# EAGLE design Amplificador_Ganho_1000_Versão5 (EAGLE 4.09)
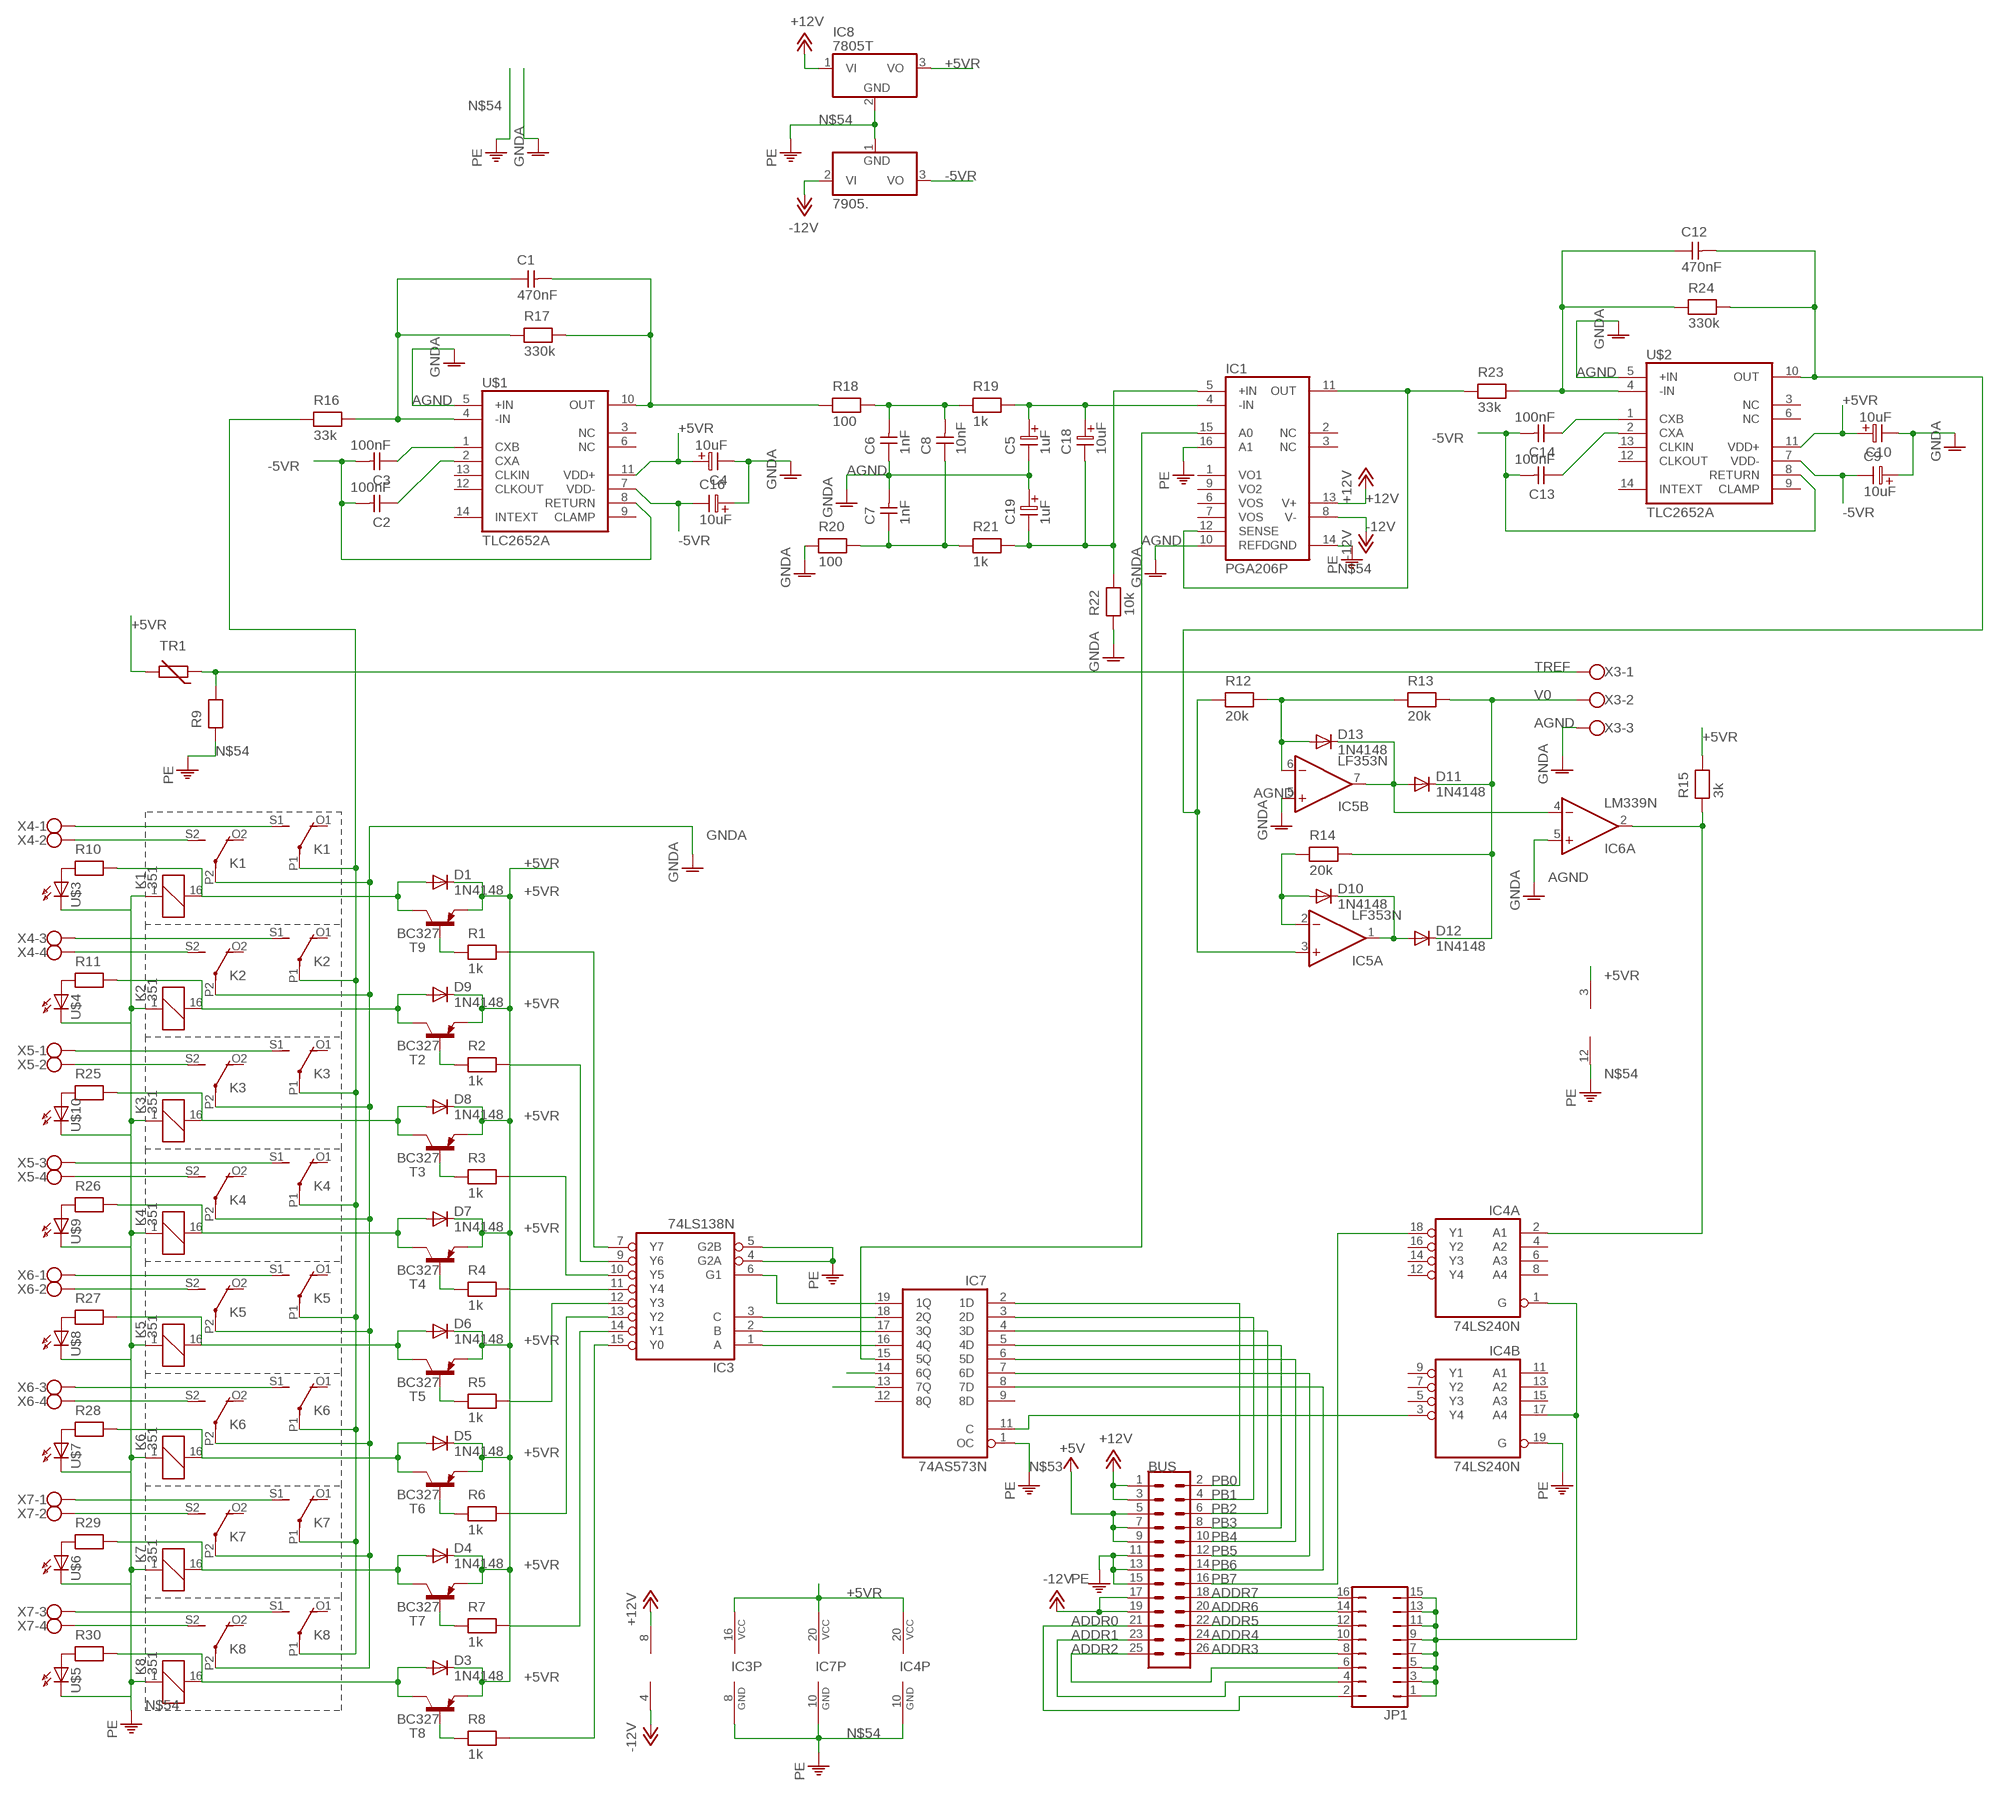
[diagram p0: schematic, sheet 1]

## Parts
7905.  7905T  [TO220H]
BUS  ML26  [ML26]
C1  470nF  CAPNP-5  [C-5]
C2  100nF  CAPNP-5  [C-5]
C3  100nF  CAPNP-5  [C-5]
C4  10uF  ELC-2,5L  [ES-2,5L]
C5  1uF  ELC-2,5L  [ES-2,5L]
C6  1nF  CAPNP-5  [C-5]
C7  1nF  CAPNP-5  [C-5]
C8  10nF  CAPNP-5  [C-5]
C9  10uF  ELC-2,5L  [ES-2,5L]
C10  10uF  ELC-2,5L  [ES-2,5L]
C12  470nF  CAPNP-5  [C-5]
C13  100nF  CAPNP-5  [C-5]
C14  100nF  CAPNP-5  [C-5]
C16  10uF  ELC-2,5L  [ES-2,5L]
C18  10uF  ELC-2,5L  [ES-2,5L]
C19  1uF  ELC-2,5L  [ES-2,5L]
D1  1N4148  [DO35-10]
D3  1N4148  [DO35-10]
D4  1N4148  [DO35-10]
D5  1N4148  [DO35-10]
D6  1N4148  [DO35-10]
D7  1N4148  [DO35-10]
D8  1N4148  [DO35-10]
D9  1N4148  [DO35-10]
D10  1N4148  [DO35-10]
D11  1N4148  [DO35-10]
D12  1N4148  [DO35-10]
D13  1N4148  [DO35-10]
IC1  PGA206P  [DIL16]
IC3  74LS138N  [DIL16]
IC4  74LS240N  [DIL20]
IC5  LF353N  [DIL08]
IC6  LM339N  [DIL14]
IC7  74AS573N  [DIL20]
IC8  7805T  [TO220H]
JP1  JP8Q  [JP8Q]
K1  351  [351]
K2  351  [351]
K3  351  [351]
K4  351  [351]
K5  351  [351]
K6  351  [351]
K7  351  [351]
K8  351  [351]
R1  1k  RESEU-10  [R-10]
R2  1k  RESEU-10  [R-10]
R3  1k  RESEU-10  [R-10]
R4  1k  RESEU-10  [R-10]
R5  1k  RESEU-10  [R-10]
R6  1k  RESEU-10  [R-10]
R7  1k  RESEU-10  [R-10]
R8  1k  RESEU-10  [R-10]
R9  RESEU-10  [R-10]
R10  RESEU-10  [R-10]
R11  RESEU-10  [R-10]
R12  20k  RESEU-10  [R-10]
R13  20k  RESEU-10  [R-10]
R14  20k  RESEU-10  [R-10]
R15  3k  RESEU-10  [R-10]
R16  33k  RESEU-10  [R-10]
R17  330k  RESEU-10  [R-10]
R18  100  RESEU-10  [R-10]
R19  1k  RESEU-10  [R-10]
R20  100  RESEU-10  [R-10]
R21  1k  RESEU-10  [R-10]
R22  10k  RESEU-10  [R-10]
R23  33k  RESEU-10  [R-10]
R24  330k  RESEU-10  [R-10]
R25  RESEU-10  [R-10]
R26  RESEU-10  [R-10]
R27  RESEU-10  [R-10]
R28  RESEU-10  [R-10]
R29  RESEU-10  [R-10]
R30  RESEU-10  [R-10]
T2  BC327  [TO92]
T3  BC327  [TO92]
T4  BC327  [TO92]
T5  BC327  [TO92]
T6  BC327  [TO92]
T7  BC327  [TO92]
T8  BC327  [TO92]
T9  BC327  [TO92]
TR1  THERM-2,5  [RS-2,5]
U$1  TLC2652A  [DIP14]
U$2  TLC2652A  [DIP14]
U$3  LED3MM  [LED3MM]
U$4  LED3MM  [LED3MM]
U$5  LED3MM  [LED3MM]
U$6  LED3MM  [LED3MM]
U$7  LED3MM  [LED3MM]
U$8  LED3MM  [LED3MM]
U$9  LED3MM  [LED3MM]
U$10  LED3MM  [LED3MM]
X3  AK500/3  [AK500/3]
X4  AK500/4  [AK500/4]
X5  AK500/4  [AK500/4]
X6  AK500/4  [AK500/4]
X7  AK500/4  [AK500/4]

## Nets
+5V: BUS.5 BUS.7 BUS.9
+5VR: C4.1 C10.1 D1.C D3.C D4.C D5.C D6.C D7.C D8.C D9.C IC3.16(VCC) IC4.20(P:VCC) IC6.3(P:V+) IC7.20(VCC) IC8.3(VO) R15.2 T2.1(E) T3.1(E) T4.1(E) T5.1(E) T6.1(E) T7.1(E) T8.1(E) T9.1(E) TR1.2 U$1.11(VDD+) U$2.11(VDD+)
+12V: BUS.1 BUS.3 IC1.13(V+) IC5.8(P:V+) IC8.1(VI)
-5VR: 7905..3(VO) C2.2 C3.2 C9.2 C13.2 C14.2 C16.2 U$1.7(VDD-) U$1.8(RETURN) U$2.7(VDD-) U$2.8(RETURN)
-12V: 7905..2(VI) BUS.17 BUS.19 IC1.8(V-) IC5.4(P:V-)
ADDR0: BUS.21 JP1.2
ADDR1: BUS.23 JP1.4
ADDR2: BUS.25 JP1.6
ADDR3: BUS.26 JP1.8
ADDR4: BUS.24 JP1.10
ADDR5: BUS.22 JP1.12
ADDR6: BUS.20 JP1.14
ADDR7: BUS.18 JP1.16
AGND: C4.2 C5.2 C6.1 C7.2 C9.1 C10.2 C16.1 C19.1 IC1.10(REF) IC5.5(B:+IN) IC6.5(A:+IN) R20.1 R22.1 U$1.5(+IN) U$2.5(+IN) X3.3 ; supply symbol labelled GNDA
GNDA: K1.P2(3:P) K2.P2(3:P) K3.P2(3:P) K4.P2(3:P) K5.P2(3:P) K6.P2(3:P) K7.P2(3:P) K8.P2(3:P)
N$1: IC7.14(6Q)
N$2: R5.1 T5.2(B)
N$3: IC3.7(Y7) R1.2
N$4: IC3.9(Y6) R2.2
N$5: IC3.10(Y5) R3.2
N$6: IC3.11(Y4) R4.2
N$7: IC3.15(Y0) R8.2
N$8: IC3.14(Y1) R7.2
N$9: IC3.13(Y2) R6.2
N$10: R1.1 T9.2(B)
N$11: IC3.1(A) IC7.16(4Q)
N$12: IC3.2(B) IC7.17(3Q)
N$13: IC3.3(C) IC7.18(2Q)
N$14: IC3.6(G1) IC7.19(1Q)
N$15: D6.A K5.16 R27.2 T5.3(C)
N$16: C18.2 C19.2 IC1.5(+IN) R21.2 R22.2
N$17: R2.1 T2.2(B)
N$18: D1.A K1.16 R10.2 T9.3(C)
N$19: D9.A K2.16 R11.2 T2.3(C)
N$20: R6.1 T6.2(B)
N$21: R3.1 T3.2(B)
N$22: D8.A K3.16 R25.2 T3.3(C)
N$23: D5.A K6.16 R28.2 T6.3(C)
N$24: R4.1 T4.2(B)
N$25: D7.A K4.16 R26.2 T4.3(C)
N$26: R7.1 T7.2(B)
N$27: D4.A K7.16 R29.2 T7.3(C)
N$28: R8.1 T8.2(B)
N$29: D3.A K8.16 R30.2 T8.3(C)
N$30: IC3.12(Y3) R5.2
N$32: IC4.2(A:A1) IC6.2(A:OUT) R15.1
N$33: IC4.1(A:G) IC4.17(B:A4) JP1.1 JP1.3 JP1.5 JP1.7 JP1.9 JP1.11 JP1.13 JP1.15
N$34: IC7.13(7Q)
N$35: K1.S1(2:S) X4.1
N$36: K1.S2(3:S) X4.2
N$37: K2.S1(2:S) X4.3
N$38: K2.S2(3:S) X4.4
N$39: K3.S1(2:S) X5.1
N$40: K3.S2(3:S) X5.2
N$41: K4.S1(2:S) X5.3
N$42: K4.S2(3:S) X5.4
N$43: K5.S1(2:S) X6.1
N$44: K5.S2(3:S) X6.2
N$45: K6.S1(2:S) X6.3
N$46: K6.S2(3:S) X6.4
N$47: K7.S1(2:S) X7.1
N$48: K7.S2(3:S) X7.2
N$49: K8.S1(2:S) X7.3
N$50: K8.S2(3:S) X7.4
N$52: IC1.11(OUT) IC1.12(SENSE) R23.1
N$53: IC4.3(B:Y4) IC7.11(C)
N$54: 7905..1(GND) BUS.11 BUS.13 BUS.15 IC1.14(DGND) IC1.16(A1) IC3.4(G2A) IC3.5(G2B) IC3.8(GND) IC4.10(P:GND) IC4.19(B:G) IC6.12(P:V-) IC7.1(OC) IC7.10(GND) IC8.2(GND) K1.1 K2.1 K3.1 K4.1 K5.1 K6.1 K7.1 K8.1 R9.1 U$3.K(C) U$4.K(C) U$5.K(C) U$6.K(C) U$7.K(C) U$8.K(C) U$9.K(C) U$10.K(C) ; supply symbol labelled PE
N$56: D10.A IC5.2(A:-IN) R14.1
N$57: C1.2 R17.2 R18.1 U$1.10(OUT)
N$58: D10.C D12.A IC5.1(A:OUT)
N$59: K1.P1(2:P) K2.P1(2:P) K3.P1(2:P) K4.P1(2:P) K5.P1(2:P) K6.P1(2:P) K7.P1(2:P) K8.P1(2:P) R16.1
N$60: C3.1 U$1.1(CXB)
N$62: C2.1 U$1.2(CXA)
N$63: D13.A IC5.6(B:-IN) R12.2 R13.1
N$64: D11.A D13.C IC5.7(B:OUT) IC6.4(A:-IN)
N$65: C6.2 C8.2 R18.2 R19.1
N$66: C12.2 IC5.3(A:+IN) R12.1 R24.2 U$2.10(OUT)
N$67: C1.1 R16.2 R17.1 U$1.4(-IN)
N$68: IC1.15(A0) IC7.15(5Q)
N$69: C7.1 C8.1 R20.2 R21.1
N$70: C14.1 U$2.1(CXB)
N$71: C5.1 C18.1 IC1.4(-IN) R19.2
N$73: C13.1 U$2.2(CXA)
N$74: C12.1 R23.2 R24.1 U$2.4(-IN)
N$82: R10.1 U$3.A
N$83: R11.1 U$4.A
N$84: R30.1 U$5.A
N$85: R29.1 U$6.A
N$86: R28.1 U$7.A
N$87: R27.1 U$8.A
N$88: R26.1 U$9.A
N$89: R25.1 U$10.A
PB0: BUS.2 IC7.2(1D)
PB1: BUS.4 IC7.3(2D)
PB2: BUS.6 IC7.4(3D)
PB3: BUS.8 IC7.5(4D)
PB4: BUS.10 IC7.6(5D)
PB5: BUS.12 IC7.7(6D)
PB6: BUS.14 IC7.8(7D)
PB7: BUS.16 IC4.18(A:Y1)
TREF: R9.2 TR1.1 X3.1
V0: D11.C D12.C R13.2 R14.2 X3.2
Unconnected: IC1.1(VO1) IC1.2(NC) IC1.3(NC) IC1.6(VOS) IC1.7(VOS) IC1.9(VO2) IC4.4(A:A2) IC4.5(B:Y3) IC4.6(A:A3) IC4.7(B:Y2) IC4.8(A:A4) IC4.9(B:Y1) IC4.11(B:A1) IC4.12(A:Y4) IC4.13(B:A2) IC4.14(A:Y3) IC4.15(B:A3) IC4.16(A:Y2) IC6.1(B:OUT) IC6.6(B:-IN) IC6.7(B:+IN) IC6.8(C:-IN) IC6.9(C:+IN) IC6.10(D:-IN) IC6.11(D:+IN) IC6.13(D:OUT) IC6.14(C:OUT) IC7.9(8D) IC7.12(8Q) K1.O1(2:O) K1.O2(3:O) K2.O1(2:O) K2.O2(3:O) K3.O1(2:O) K3.O2(3:O) K4.O1(2:O) K4.O2(3:O) K5.O1(2:O) K5.O2(3:O) K6.O1(2:O) K6.O2(3:O) K7.O1(2:O) K7.O2(3:O) K8.O1(2:O) K8.O2(3:O) U$1.3(NC) U$1.6(NC) U$1.9(CLAMP) U$1.12(CLKOUT) U$1.13(CLKIN) U$1.14(INTEXT) U$2.3(NC) U$2.6(NC) U$2.9(CLAMP) U$2.12(CLKOUT) U$2.13(CLKIN) U$2.14(INTEXT)

## Library data of the parts
7905. = linear:79*: Negative VOLTAGE REGULATOR
BUS = con-harting-ml:ML26: HARTING
C1-C3 C6-C8 C12-C14 = discrete:CAPNP-5
C4 C5 C9 C10 C16 C18 C19 = discrete:ELC-2,5L
D1 D3-D13 = diode:1N4148: DIODE high speed (Philips)
IC1 = burr-brown:PGA206: High-Speed Programmable Gain Instrumentation Amplifier
IC3 = 74xx-us:74*138: 3-line to 8-line DECODER/DEMULTIPLEXER
IC4 = 74xx-us:74*240: Octal BUFFER and LINE DRIVER, 3-state
IC5 = linear:LF353: OP AMP
IC6 = linear:LM339: COMPARATOR
IC7 = 74xx-us:74*573: 8-bit D latch BUS DRIVER
IC8 = linear:78*: Positive VOLTAGE REGULATOR
JP1 = jumper:JP8Q: JUMPER
K1-K8 = relay:351: RELAY 2 x switch, Omron
R1-R30 = discrete:RESEU-10
T2-T9 = transistor-pnp:BC327: PNP Transistor
TR1 = discrete:THERM-2,5
U$1 U$2 = ti:TLC2652A
U$3-U$10 = led:LED: LED
X3 = con-ptr500:AK500/3: CONNECTOR
X4-X7 = con-ptr500:AK500/4: CONNECTOR

## Board
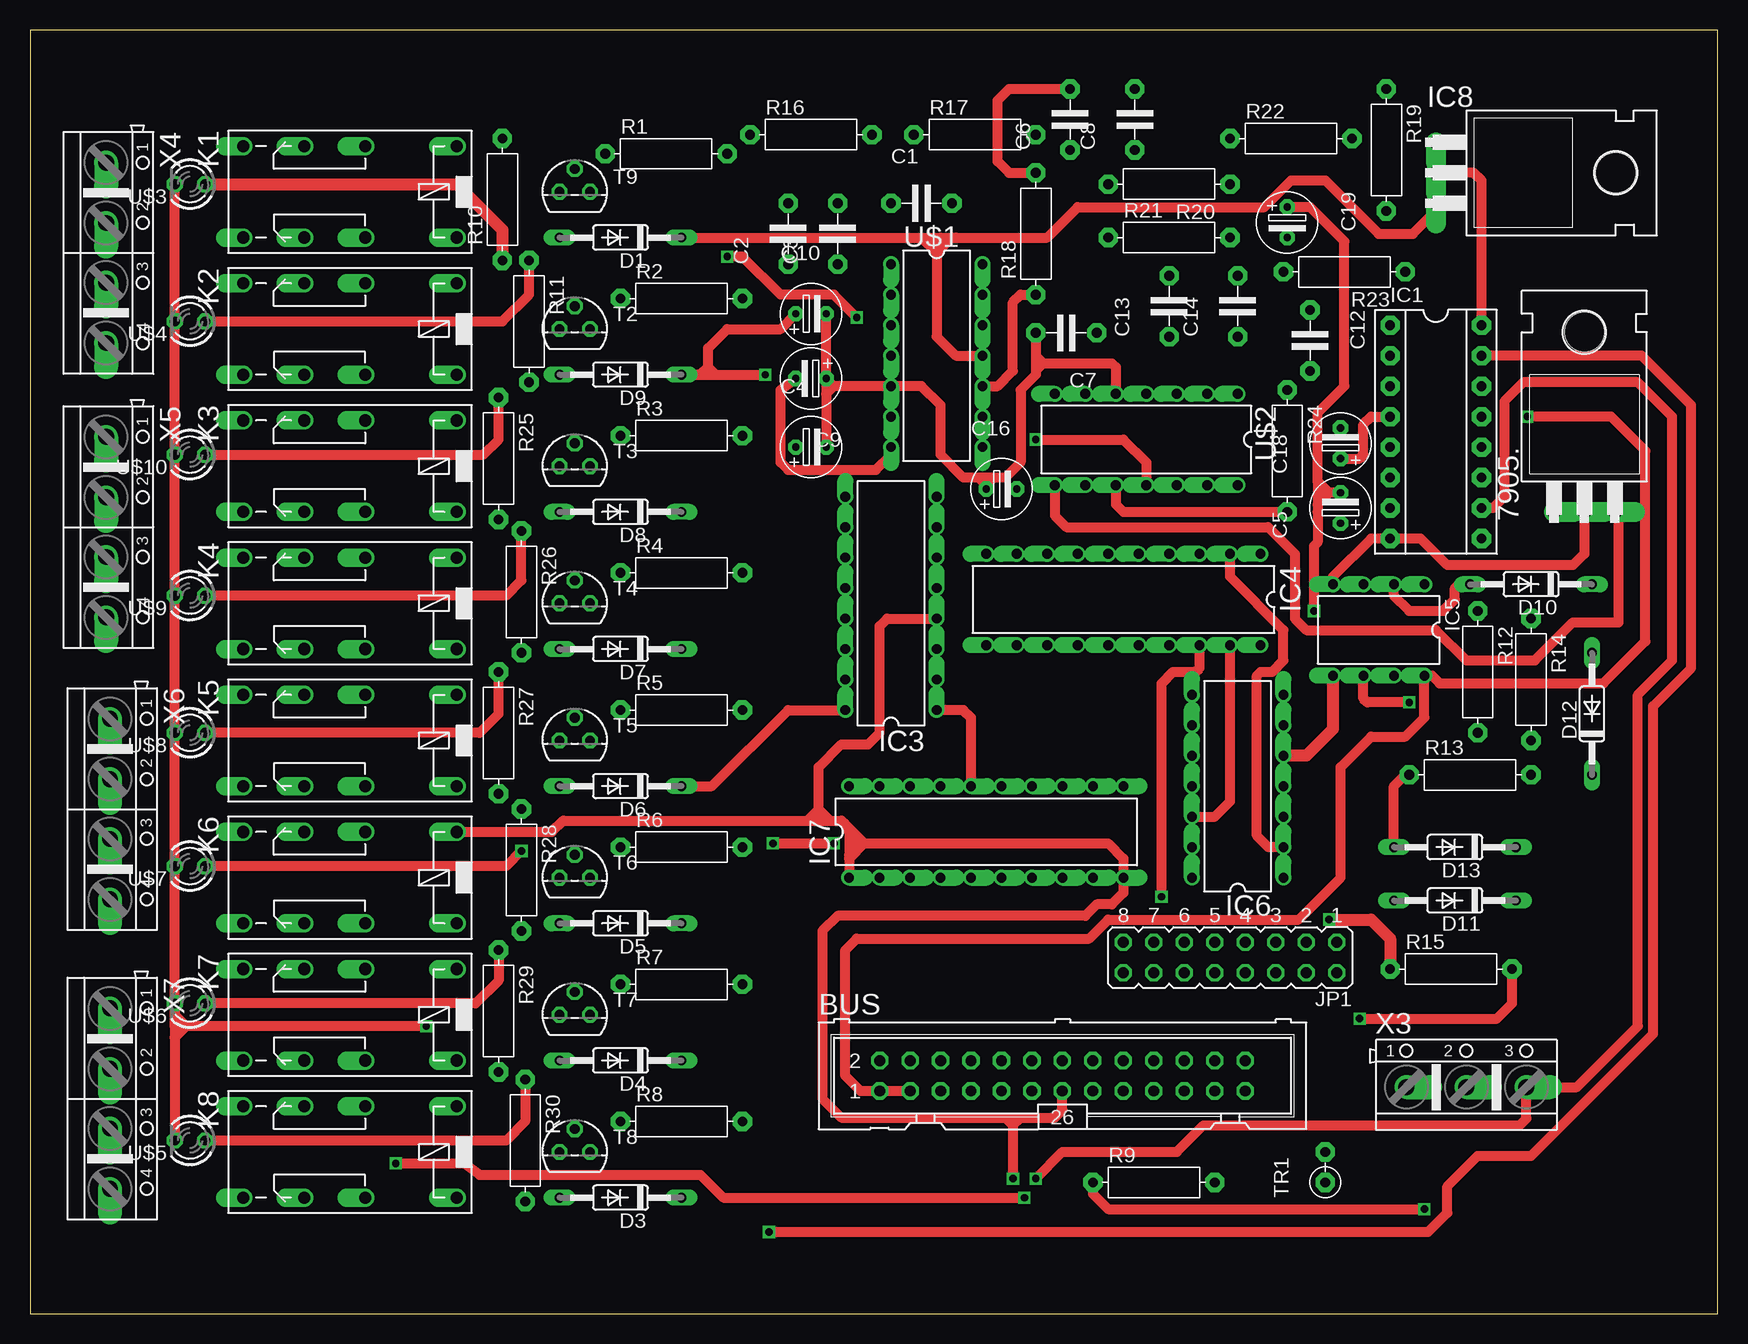
[diagram p1: board, top side]
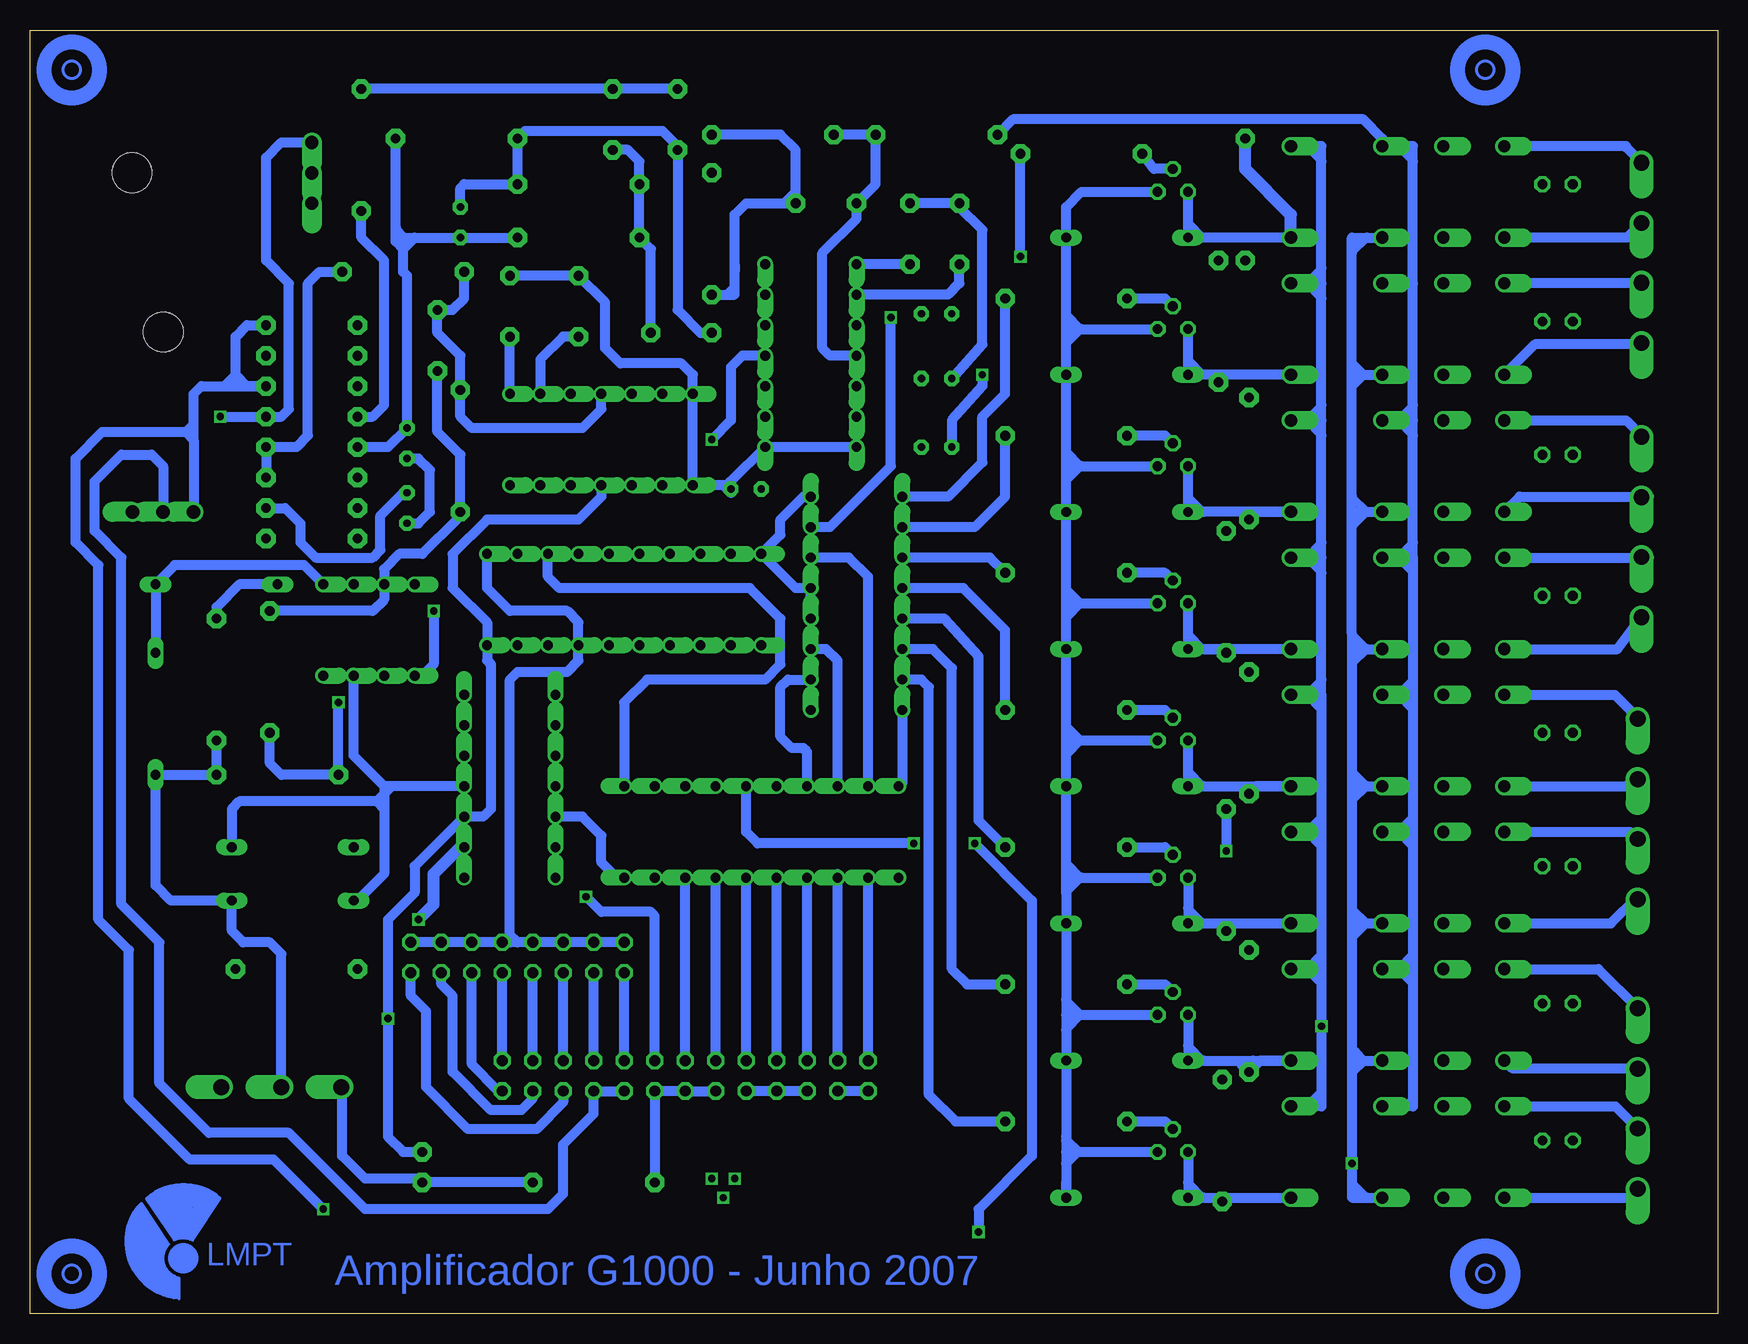
[diagram p2: board, bottom side, seen from below]

Size 140.63 x 106.98 mm. Coordinates in mm from the lower left corner, seen from the top.
Outline: 0,0 140.63,0 140.63,106.99 0,106.99 0,0
Copper layers used: Top, Bottom

### Footprints (pad centres in the part's own frame; a part is rotated, then mirrored left to right if it is on the bottom)
TO220H = drill 1.118 offset: 1 -2.54,-10.16; 2 0,-10.16; 3 2.54,-10.16 | hole 3.302: 0,4.826
ML26 = drill 0.914 octagon: 1 -15.24,-1.27; 2 -15.24,1.27; 3 -12.7,-1.27; 4 -12.7,1.27; 5 -10.16,-1.27; 6 -10.16,1.27; 7 -7.62,-1.27; 8 -7.62,1.27; 9 -5.08,-1.27; 10 -5.08,1.27; 11 -2.54,-1.27; 12 -2.54,1.27; 13 0,-1.27; 14 0,1.27; 15 2.54,-1.27; 16 2.54,1.27; 17 5.08,-1.27; 18 5.08,1.27; 19 7.62,-1.27; 20 7.62,1.27; 21 10.16,-1.27; 22 10.16,1.27; 23 12.7,-1.27; 24 12.7,1.27; 25 15.24,-1.27; 26 15.24,1.27
C-5 = drill 0.813 pad 1.6 octagon: 1 -2.54,0; 2 2.54,0
ES-2,5L = drill 0.61 pad 1.27 octagon: 1 0,0; 2 2.54,0
DO35-10 = drill 0.813 long: A 5.08,0; C -5.08,0
DIL16 = drill 0.813 pad 1.6 octagon: 1 -8.89,-3.81; 2 -6.35,-3.81; 3 -3.81,-3.81; 4 -1.27,-3.81; 5 1.27,-3.81; 6 3.81,-3.81; 7 6.35,-3.81; 8 8.89,-3.81; 9 8.89,3.81; 10 6.35,3.81; 11 3.81,3.81; 12 1.27,3.81; 13 -1.27,3.81; 14 -3.81,3.81; 15 -6.35,3.81; 16 -8.89,3.81
DIL16' = drill 0.813 offset: 1 -8.89,-3.81; 2 -6.35,-3.81; 3 -3.81,-3.81; 4 -1.27,-3.81; 5 1.27,-3.81; 6 3.81,-3.81; 7 6.35,-3.81; 8 8.89,-3.81; 9 8.89,3.81; 10 6.35,3.81; 11 3.81,3.81; 12 1.27,3.81; 13 -1.27,3.81; 14 -3.81,3.81; 15 -6.35,3.81; 16 -8.89,3.81
DIL20 = drill 0.813 offset: 1 -11.43,-3.81; 2 -8.89,-3.81; 3 -6.35,-3.81; 4 -3.81,-3.81; 5 -1.27,-3.81; 6 1.27,-3.81; 7 3.81,-3.81; 8 6.35,-3.81; 9 8.89,-3.81; 10 11.43,-3.81; 11 11.43,3.81; 12 8.89,3.81; 13 6.35,3.81; 14 3.81,3.81; 15 1.27,3.81; 16 -1.27,3.81; 17 -3.81,3.81; 18 -6.35,3.81; 19 -8.89,3.81; 20 -11.43,3.81
DIL08 = drill 0.813 offset: 1 -3.81,-3.81; 2 -1.27,-3.81; 3 1.27,-3.81; 4 3.81,-3.81; 5 3.81,3.81; 6 1.27,3.81; 7 -1.27,3.81; 8 -3.81,3.81
DIL14 = drill 0.813 offset: 1 -7.62,-3.81; 2 -5.08,-3.81; 3 -2.54,-3.81; 4 0,-3.81; 5 2.54,-3.81; 6 5.08,-3.81; 7 7.62,-3.81; 8 7.62,3.81; 9 5.08,3.81; 10 2.54,3.81; 11 0,3.81; 12 -2.54,3.81; 13 -5.08,3.81; 14 -7.62,3.81
JP8Q = drill 0.914 octagon: 1 -8.89,-1.27; 2 -8.89,1.27; 3 -6.35,-1.27; 4 -6.35,1.27; 5 -3.81,-1.27; 6 -3.81,1.27; 7 -1.27,-1.27; 8 -1.27,1.27; 9 1.27,-1.27; 10 1.27,1.27; 11 3.81,-1.27; 12 3.81,1.27; 13 6.35,-1.27; 14 6.35,1.27; 15 8.89,-1.27; 16 8.89,1.27
351 = drill 1.016 offset: 1 -3.81,-3.81; 16 -3.81,3.81; O1 8.89,-3.81; O2 8.89,3.81; P1 3.81,-3.81; P2 3.81,3.81; S1 13.97,-3.81; S2 13.97,3.81
R-10 = drill 0.813 pad 1.6 octagon: 1 -5.08,0; 2 5.08,0
TO92 = drill 0.813 octagon: 1 1.27,0; 2 0,1.905; 3 -1.27,0
RS-2,5 = drill 0.813 pad 1.6 octagon: 1 0,0; 2 2.54,0
DIP14 = drill 0.813 offset: 1 -7.62,-3.81; 2 -5.08,-3.81; 3 -2.54,-3.81; 4 0,-3.81; 5 2.54,-3.81; 6 5.08,-3.81; 7 7.62,-3.81; 8 7.62,3.81; 9 5.08,3.81; 10 2.54,3.81; 11 0,3.81; 12 -2.54,3.81; 13 -5.08,3.81; 14 -7.62,3.81
LED3MM = drill 0.813 octagon: A -1.27,0; K 1.27,0
AK500/3 = drill 1.321 offset: 1 -5.004,0; 2 0,0; 3 5.004,0
AK500/4 = drill 1.321 offset: 1 -7.518,0; 2 -2.489,0; 3 2.489,0; 4 7.518,0

### Placement (x,y rotation side)
7905.  129.53,76.99 0 top
BUS  86.04,19.84 0 top
C1  74.29,92.55 0 top
C2  63.18,90 90 top
C3  67.3,90 90 top
C4  63.81,72.22 0 top
C5  109.22,65.88 90 top
C6  86.67,99.53 90 top
C7  86.35,81.75 180 top
C8  92.07,99.53 90 top
C9  66.35,77.94 180 top
C10  63.81,83.34 0 top
C12  106.67,81.11 270 top
C13  94.93,83.97 90 top
C14  100.64,83.97 90 top
C16  79.69,68.73 0 top
C18  109.22,71.27 90 top
C19  104.77,92.23 270 top
D1  49.21,89.69 180 top
D3  49.21,9.68 180 top
D4  49.21,21.11 180 top
D5  49.21,32.54 180 top
D6  49.21,43.97 180 top
D7  49.21,55.4 180 top
D8  49.21,66.83 180 top
D9  49.21,78.26 180 top
D10  125.09,60.8 180 top
D11  118.74,34.44 180 top
D12  130.17,50 90 top
D13  118.74,38.89 180 top
IC1  117.15,73.5 270 top
IC3  74LS138N  [DIL16']  71.75,59.21 90 top
IC4  91.12,59.53 180 top
IC5  112.39,56.98 180 top
IC6  100.64,43.97 90 top
IC7  79.69,40.16 0 top
IC8  127.31,95.08 270 top
JP1  100.01,29.68 180 top
K1  31.74,93.5 180 top
K2  31.74,82.07 180 top
K3  31.74,70.64 180 top
K4  31.74,59.21 180 top
K5  31.74,47.78 180 top
K6  31.74,36.35 180 top
K7  31.74,24.92 180 top
K8  31.74,13.49 180 top
R1  53.02,96.67 0 top
R2  54.29,84.61 0 top
R3  54.29,73.18 0 top
R4  54.29,61.75 0 top
R5  54.29,50.32 0 top
R6  54.29,38.89 0 top
R7  54.29,27.46 0 top
R8  54.29,16.03 0 top
R9  93.66,10.95 0 top
R10  39.36,92.86 90 top
R11  41.59,82.7 270 top
R12  120.64,53.49 270 top
R13  120.01,44.92 0 top
R14  125.09,52.86 270 top
R15  118.42,28.73 0 top
R16  65.08,98.26 0 top
R17  78.73,98.26 0 top
R18  83.81,90 90 top
R19  113.02,96.99 270 top
R20  94.93,94.13 180 top
R21  94.93,89.69 0 top
R22  105.09,97.94 0 top
R23  109.53,86.83 180 top
R24  104.77,71.91 270 top
R25  39.05,71.27 270 top
R26  40.95,60.16 270 top
R27  39.05,48.41 270 top
R28  40.95,36.98 270 top
R29  39.05,25.23 270 top
R30  41.27,14.44 270 top
T2  45.4,82.07 0 top
T3  45.4,70.64 0 top
T4  45.4,59.21 0 top
T5  45.4,47.78 0 top
T6  45.4,36.35 0 top
T7  45.4,24.92 0 top
T8  45.4,13.49 0 top
T9  45.4,93.5 0 top
TR1  107.94,10.95 90 top
U$1  75.56,79.84 270 top
U$2  93.02,72.86 180 top
U$3  13.33,94.13 180 top
U$4  13.33,82.7 180 top
U$5  13.33,14.44 180 top
U$6  13.33,25.87 180 top
U$7  13.33,37.3 180 top
U$8  13.33,48.41 180 top
U$9  13.33,59.84 180 top
U$10  13.33,71.59 180 top
X3  119.69,18.88 0 top
X4  6.34,88.42 270 top
X5  6.34,65.56 270 top
X6  6.66,42.06 270 top
X7  6.66,17.93 270 top

### Tracks (layer width: path | path; a pad name or v marks a point on that pad's centre or on a via)
+5V
  Bottom 0.813: BUS.5 BUS.7 BUS.9
+5VR  (via drill 0.61)
  Top 0.813: U$1.11 77.15,79.85 75.56,81.43 75.56,88.42 | 74.29,89.69 D1.C 53.97,89.69 | 74.29,89.69 75.56,88.42 | 76.83,89.69 77.15,89.69 | 74.29,89.69 76.83,89.69 | 75.56,88.42 76.83,89.69 | 75.56,88.42 75.56,89.37 75.88,89.69 84.77,89.69 87.31,92.23 102.87,92.23 105.09,94.45 107.94,94.45 112.39,90.01 115.25,90.01 117.15,91.91 IC8.3 | 56.51,78.89 56.51,80.48 58.1,82.07 62.54,82.07 C10.1 | D9.C 55.56,78.26 | v83.81,72.86 91.12,72.86 93.02,70.96 U$2.11 | v110.8,24.6 122.23,24.6 123.5,25.87 R15.2 | D6.C 56.83,43.97 63.18,50.32 IC3.16 | 57.14,78.26 v61.27,78.26 | 56.83,78.26 57.14,78.26 | 55.56,78.26 56.83,78.26 | 55.56,78.26 55.88,78.26 56.51,78.89 | 56.83,78.26 56.83,78.58 56.51,78.89 | 56.51,78.89 57.14,78.26
  Bottom 0.61: 54.29,35.08 53.02,36.35 54.29,37.62 | 54.29,49.05 53.02,47.78 54.29,46.51 | 54.29,60.48 53.02,59.21 54.29,57.94 | 54.29,71.91 53.02,70.64 54.29,69.37 | 54.29,83.34 53.02,82.07 54.29,80.8 | 54.29,26.19 53.02,24.92 54.29,23.65
  Bottom 0.813: 54.29,24.92 54.29,23.65 D4.C 54.29,14.76 | 54.29,24.92 53.02,24.92 T7.1 | 54.29,36.35 54.29,35.08 D5.C 54.29,26.19 54.29,24.92 | 54.29,36.35 53.02,36.35 T6.1 | 54.29,47.78 54.29,46.51 D6.C 54.29,37.62 54.29,36.35 | 54.29,47.78 53.02,47.78 T5.1 | 54.29,59.21 54.29,57.94 D7.C 54.29,49.05 54.29,47.78 | 54.29,59.21 53.02,59.21 T4.1 | 54.29,70.64 54.29,69.37 D8.C 54.29,60.48 54.29,59.21 | 54.29,70.64 53.02,70.64 T3.1 | 54.29,82.07 54.29,80.8 D9.C 54.29,71.91 54.29,70.64 | 54.29,82.07 53.02,82.07 T2.1 | 54.29,82.07 54.29,83.34 D1.C 54.29,92.23 53.02,93.5 T9.1 | IC3.16 67.94,44.29 IC7.20 | 54.29,10.95 D3.C 54.29,12.54 | 54.29,13.49 54.29,12.54 | 53.33,13.49 T8.1 | 54.29,13.49 53.33,13.49 | 54.29,14.76 54.29,13.49 | 54.29,14.76 54.29,14.44 53.33,13.49 | 53.33,13.49 54.29,12.54 | U$1.11 81.28,79.85 82.23,78.89 82.23,74.45 v83.81,72.86 | v61.27,78.26 61.27,77.3 63.81,74.45 C4.1 | U$2.11 93.02,68.1 94.93,66.19 102.55,66.19 105.4,63.33 105.4,60.48 102.55,57.62 IC4.20 102.55,54.44 102.23,54.13 102.23,42.06 102.87,41.43 IC6.3 108.58,37.3 108.58,35.08 110.8,32.85 v110.8,24.6 110.8,14.76 109.53,13.49 TR1.2
+12V  (via drill 0.61)
  Top 0.813: BUS.3 69.21,18.57 67.94,19.84 67.94,30.32 68.89,31.27 88.26,31.27 89.85,32.85 105.72,32.85 109.22,36.35 109.22,45.56 111.76,48.09 114.61,48.09 116.2,49.68 IC5.8 116.83,53.18 117.47,52.54 131.12,52.54 134.62,56.03 134.62,71.91 131.76,74.76 v124.77,74.76
  Bottom 0.813: IC8.1 119.69,97.63 120.96,96.35 120.96,87.78 119.06,85.88 119.06,75.4 119.69,74.76 IC1.13 v124.77,74.76 | BUS.1 BUS.3
-5VR
  Top 0.813: U$1.7 71.75,71.59 70.48,70.32 63.18,70.32 62.54,70.96 62.54,76.99 C9.2 | U$2.8 85.4,66.51 86.35,65.56 103.18,65.56 105.4,63.33 105.4,57.94 106.36,56.98 117.15,56.98 119.69,54.44 125.41,54.44 128.58,57.62 132.39,57.62 132.39,66.51 7905..3
  Bottom 0.813: U$1.7 U$1.8 82.23,69.37 | 82.55,69.05 82.86,69.05 | 82.86,69.05 U$2.8 U$2.7 85.4,78.26 86.35,79.21 91.44,79.21 92.71,80.48 92.71,84.29 C13.2 C14.2 | 82.23,69.37 C16.2 | C16.2 82.23,68.41 82.55,68.73 | 82.23,69.37 82.55,69.05 | 82.55,69.05 82.55,68.73 | 82.86,69.05 82.55,68.73 | C3.2 C2.2 63.18,92.23 61.27,90.32 61.27,80.8 C9.2 | C16.2 82.55,68.73
-12V
  Top 0.813: IC5.4 108.58,61.43 111.76,64.61 IC1.8 115.88,64.61 118.11,62.38 128.58,62.38 129.54,63.33 7905..2
  Bottom 0.813: BUS.17 BUS.19 93.66,16.66 96.2,14.12 96.2,10 97.47,8.73 112.71,8.73 119.06,15.07 125.72,15.07 129.85,19.2 129.85,30.95 133.03,34.12 133.03,63.02 135.25,65.24 135.25,69.37 133.03,71.59 130.49,71.59 129.54,70.64 7905..2
ADDR0
  Bottom 0.813: BUS.21 96.2,17.61 98.42,15.39 104.13,15.39 107.63,18.89 107.63,25.24 108.9,26.51 JP1.2
ADDR1
  Bottom 0.813: JP1.4 106.36,27.46 105.4,26.51 105.4,20.15 102.23,16.98 99.69,16.98 98.74,17.93 BUS.23 98.74,18.89
ADDR2
  Bottom 0.813: BUS.25 101.6,18.57 103.82,20.79 JP1.6
ADDR3
  Bottom 0.813: BUS.26 JP1.8
ADDR4
  Bottom 0.813: BUS.24 JP1.10
ADDR5
  Bottom 0.813: BUS.22 JP1.12
ADDR6
  Bottom 0.813: BUS.20 JP1.14
ADDR7
  Bottom 0.813: BUS.18 JP1.16
AGND  (via drill 0.61)
  Top 0.813: 83.81,79.85 83.81,79.21 | C7.2 83.81,79.85 | 79.05,69.68 77.78,69.68 75.88,71.59 75.88,75.72 74.29,77.3 U$1.5 66.99,77.3 | 79.69,69.68 79.05,69.68 | 80.32,69.68 81.28,69.68 82.55,70.96 82.55,76.99 83.81,78.26 83.81,78.58 | U$2.5 90.48,78.89 90.17,79.21 84.45,79.21 | 83.81,79.21 84.45,79.21 | 83.81,79.21 83.81,78.58 | 83.81,79.85 84.45,79.21 | 84.45,79.21 83.81,78.58 | 79.69,69.68 79.69,69.05 | 80.32,69.68 79.69,69.68 | 80.32,69.68 79.69,69.05 | 79.69,69.05 79.05,69.68 | 108.26,68.41 107.31,69.37 | 107.31,69.37 107.31,75.08 109.53,77.3 109.53,89.37 106.68,92.23 C19.1 | v106.99,58.57 106.99,63.97 107.31,64.29 107.31,66.83 | 107.31,69.37 107.31,66.83 | 107.31,66.83 107.31,67.46 108.26,68.41 | v83.81,11.26 86.04,13.49 95.56,13.49 97.78,15.71 124.14,15.71 124.7,16.27 X3.3 128.9,18.89 133.98,23.96 133.98,51.59 136.84,54.44 136.84,74.76 133.98,77.62 124.45,77.62 122.87,76.04 122.87,68.1 121.91,67.15 IC1.10 | 79.69,69.05 C16.1 | C9.1 66.35,76.67 | 66.35,76.67 C4.2 | C5.2 108.26,68.41 | C9.1 C10.2 | 66.99,77.3 C9.1 | 66.99,77.3 66.35,76.67
  Top 1.016: IC5.5 108.58,48.73 106.36,46.51 IC6.5
  Bottom 0.813: C7.2 84.77,81.75 86.67,83.66 C6.1 86.67,97.31 87.94,98.58 99.37,98.58 R22.1 R20.1 104.45,94.13 104.77,93.82 C19.1 | IC5.5 107.94,53.18 106.99,54.13 v106.99,58.57 | IC1.10 119.37,67.15 118.11,65.87 118.11,64.29 116.83,63.02 112.07,63.02 111.44,63.65 111.44,66.51 109.53,68.41 C5.2
GNDA  (via drill 0.61)
  Top 0.813: v82.86,9.68 57.78,9.68 55.88,11.58 37.46,11.58 36.19,12.54 v30.47,12.54
  Bottom 0.61: 30.47,10.95 29.2,9.68 | 30.47,21.74 29.84,21.11 30.47,20.47 | 30.47,31.27 29.2,32.54 30.47,33.81 | 30.47,45.24 29.2,43.97 30.47,42.7 | 30.47,54.13 29.2,55.4 30.47,56.67 | 30.47,65.56 29.2,66.83 30.47,68.1 | 30.47,88.42 29.2,89.69
  Bottom 0.813: 30.47,32.54 29.2,32.54 K6.P2 | 30.47,32.54 30.47,31.27 30.47,22.38 | 30.47,22.38 30.47,21.74 | 30.47,21.74 30.47,21.11 | 30.47,21.11 29.84,21.11 29.52,21.11 | 29.52,21.11 K7.P2 | 30.47,21.11 30.47,20.47 30.47,20.15 | 30.47,20.15 v30.47,12.54 30.47,10.95 30.47,9.68 29.2,9.68 K8.P2 | 30.47,43.97 29.2,43.97 K5.P2 | 30.47,43.97 30.47,42.7 30.47,33.81 30.47,32.54 | K4.P2 29.2,55.4 30.47,55.4 | 30.47,55.4 30.47,54.13 30.47,45.24 30.47,43.97 | 30.47,66.83 29.2,66.83 K3.P2 | 30.47,55.4 30.47,56.67 30.47,65.56 30.47,66.83 | 30.47,78.26 29.52,78.26 | 29.52,78.26 K2.P2 | 30.47,66.83 30.47,68.1 30.47,77.3 | 30.47,77.3 30.47,78.26 | K1.P2 29.2,89.69 30.47,89.69 30.47,88.42 30.47,79.21 | 30.47,78.26 30.47,79.21 | 30.16,21.74 29.52,21.11 | 30.47,21.74 30.16,21.74 | 30.16,21.74 30.47,22.06 30.47,22.38 | 29.52,21.11 30.47,20.15 | 30.47,77.3 29.52,78.26 | 29.52,78.26 30.47,79.21
N$2
  Bottom 0.813: R5.1 46.03,50.32 T5.2
N$3  (via drill 0.61)
  Top 0.813: v58.1,88.1 59.37,88.1 62.54,84.93 66.99,84.93 v68.89,83.02
  Bottom 0.813: IC3.7 73.97,65.56 68.89,70.64 v68.89,83.02 | v58.1,88.1 R1.2
N$4
  Bottom 0.813: R2.2 59.37,76.67 61.27,74.76 61.27,70.96 64.13,68.1 IC3.9
N$5
  Bottom 0.813: IC3.10 61.91,65.56 59.37,68.1 R3.2
N$6
  Bottom 0.813: IC3.11 60.64,63.02 R4.2
N$7
  Bottom 0.813: IC3.15 66.35,52.86 65.72,52.22 65.72,18.25 63.49,16.03 R8.2
N$8
  Bottom 0.813: IC3.14 65.4,55.4 63.81,53.81 63.81,28.73 62.54,27.46 R7.2
N$9
  Bottom 0.813: IC3.13 64.45,57.94 61.59,54.76 61.59,41.11 R6.2
N$10
  Bottom 0.813: R1.1 46.99,95.4 T9.2
N$11
  Top 0.813: IC3.1 77.78,50.32 78.42,49.68 IC7.16
N$12
  Bottom 0.813: IC3.2 77.47,52.86 78.1,52.22 78.1,48.09 77.15,47.14 76.19,47.14 75.88,46.83 IC7.17
N$13
  Bottom 0.813: IC3.3 74.29,55.4 73.34,54.44 IC7.18
N$14
  Bottom 0.813: IC7.19 70.8,61.43 72.39,63.02 IC3.6
N$15
  Bottom 0.61: 44.13,45.24 42.86,43.97
  Bottom 0.813: T5.3 44.13,45.24 D6.A 42.86,43.97 K5.16 38.41,43.97 R27.2
N$16
  Bottom 0.813: 109.53,89.69 110.17,90.32 110.17,90.64 | 110.17,90.64 R22.2 | 109.53,88.74 109.53,89.69 | 109.53,89.69 108.58,89.69 | 109.53,88.74 108.58,89.69 | 109.53,88.74 109.53,89.05 110.17,89.69 110.17,90.64 | 110.17,90.64 110.17,89.37 109.53,88.74 | IC1.5 110.8,72.22 C18.2 109.22,86.51 109.53,86.83 109.53,88.74 | R21.2 C19.2 108.58,89.69
N$17
  Bottom 0.813: R2.1 46.03,84.61 T2.2
N$18
  Bottom 0.61: 42.86,89.69 44.13,90.96
  Bottom 0.813: T9.3 44.13,90.96 D1.A 42.86,89.69 K1.16
  Bottom 1.016: K1.16 35.55,91.59 39.37,95.4 R10.2
N$19
  Bottom 0.61: 42.86,78.26 44.13,79.53
  Bottom 0.813: T2.3 44.13,79.53 D9.A 43.49,78.26 | K2.16 42.22,78.26 | 42.22,78.26 42.86,78.26 43.49,78.26 | 42.22,78.26 43.49,78.26 | 42.22,78.26 R11.2 41.27,77.62
N$20
  Bottom 0.813: R6.1 46.03,38.89 T6.2
N$21
  Bottom 0.813: R3.1 46.03,73.18 T3.2
N$22
  Bottom 0.61: 42.86,66.83 44.13,68.1
  Bottom 0.813: T3.3 44.13,68.1 D8.A 42.86,66.83 K3.16 38.41,66.83 R25.2
N$23
  Bottom 0.61: 44.13,33.81 42.86,32.54
  Bottom 0.813: 42.86,32.54 D5.A 44.13,33.81 T6.3 | 42.86,32.54 K6.16 | 42.86,32.54 41.59,32.54 R28.2
N$24
  Bottom 0.813: R4.1 46.03,61.75 T4.2
N$25
  Bottom 0.61: 42.86,55.4 44.13,56.67
  Bottom 0.813: T4.3 44.13,56.67 D7.A 42.86,55.4 | K4.16 42.86,55.4 | 42.86,55.4 41.27,55.4 R26.2
N$26
  Bottom 0.813: R7.1 46.03,27.46 T7.2
N$27
  Bottom 0.61: 44.13,22.38 42.86,21.11
  Bottom 0.813: T7.3 44.13,22.38 D4.A 42.86,21.11 38.73,21.11 | 35.87,21.11 38.09,21.11 R29.2 | R29.2 39.68,20.79 38.73,20.79 | R29.2 39.05,20.79 38.73,21.11 | 38.73,21.11 35.87,21.11 | 35.87,21.11 K7.16
N$28
  Bottom 0.813: R8.1 46.03,16.03 T8.2
N$29
  Bottom 0.61: 44.13,10.95 42.86,9.68
  Bottom 0.813: T8.3 44.13,10.95 D3.A 42.86,9.68 | 42.86,9.68 K8.16 | 42.86,9.68 41.59,9.68 R30.2
N$30
  Bottom 0.813: IC3.12 62.86,60.48 59.37,56.98 R5.2
N$32  (via drill 0.61)
  Top 0.813: IC4.2 100.01,61.43 104.45,56.98 104.45,54.44 103.5,53.49 102.55,53.49 102.23,53.18 102.23,39.84 103.18,38.89 IC6.2
  Top 1.016: v108.26,32.85 111.76,32.85 113.34,31.27 R15.1
  Bottom 1.016: IC6.2 104.77,38.89 106.99,36.67 106.99,34.12 v108.26,32.85
N$33
  Bottom 0.813: JP1.15 JP1.13 JP1.11 | JP1.11 JP1.9 | JP1.7 JP1.5 | JP1.5 JP1.3 | JP1.5 JP1.3 | JP1.3 JP1.1 | JP1.5 JP1.3 | 100.64,30.95 JP1.7 | 100.01,30.95 100.64,30.95 | JP1.9 100.01,30.95 | JP1.11 JP1.9 | JP1.11 JP1.9 | JP1.11 JP1.9 | 100.64,30.95 100.64,31.59 | 100.01,30.95 100.64,31.59 | 100.64,31.59 JP1.7 | 100.64,31.59 100.64,52.86 100.01,53.49 95.88,53.49 94.93,54.44 IC4.17 94.93,57.62 95.88,58.57 100.64,58.57 102.55,60.48 IC4.1
N$35
  Bottom 0.813: K1.S1 7.62,97.31 7.62,97.21 X4.1
N$36
  Bottom 0.813: X4.2 7.56,89.69 K1.S2
N$37
  Bottom 0.813: X4.3 6.34,85.88 K2.S1
N$38
  Bottom 0.813: K2.S2 15.23,80.8 6.45,80.8 X4.4
N$39
  Bottom 0.813: K3.S1 7.62,74.45 6.34,73.18 X5.1
N$40
  Bottom 0.813: X5.2 5.71,68.1 16.51,68.1 K3.S2
N$41
  Bottom 0.813: X5.3 5.71,63.02 K4.S1
N$42
  Bottom 0.813: X5.4 8.35,55.4 K4.S2
N$43
  Bottom 0.813: X6.1 6.66,49.68 8.57,51.59 K5.S1
N$44
  Bottom 0.813: X6.2 6.93,44.55 6.98,44.6 7.62,43.97 K5.S2
N$45
  Bottom 0.813: X6.3 6.66,39.52 7.3,40.16 K6.S1
N$46
  Bottom 0.813: X6.4 6.66,34.76 8.88,32.54 K6.S2
N$47
  Bottom 0.813: X7.1 9.94,28.73 K7.S1
N$48
  Bottom 0.813: X7.2 6.66,20.47 17.14,20.47 K7.S2
N$49
  Bottom 0.813: X7.3 8.52,17.3 K8.S1
N$50
  Bottom 0.813: X7.4 7.4,9.68 K8.S2
N$51  (via drill 0.61)
  other vias: 58.1,88.1
N$52
  Bottom 0.813: R23.1 116.52,86.83 117.47,85.88 117.47,73.18 118.42,72.22 IC1.12 IC1.11
N$53
  Bottom 0.813: IC4.3 97.47,61.43 96.51,60.48 80.64,60.48 78.1,57.94 78.1,54.13 79.37,52.86 89.21,52.86 91.12,50.95 IC7.11
N$54  (via drill 0.61)
  Top 0.813: K6.1 43.49,40.16 44.44,41.11 64.77,41.11 | IC7.1 68.26,37.93 69.53,39.2 | 69.53,39.2 89.85,39.2 91.12,37.93 IC7.10 91.12,35.08 90.17,34.12 88.9,34.12 87.94,33.17 67.31,33.17 66.03,31.9 66.03,17.93 67.62,16.34 81.28,16.34 | IC8.2 120.33,95.08 120.96,94.45 IC1.16 | 81.28,16.34 81.59,16.34 | 81.59,16.34 82.55,16.34 | 82.55,16.34 85.4,16.34 86.04,16.98 BUS.13 | IC3.4 71.43,57.94 70.8,57.3 70.8,48.41 69.84,47.46 67.62,47.46 65.72,45.56 65.72,42.06 | 65.72,42.06 65.72,41.11 64.77,41.11 | 64.77,41.11 66.67,41.11 | 67.62,41.11 67.94,40.79 | 67.94,40.79 68.26,40.47 | 68.26,40.47 68.26,38.25 | 68.26,40.47 68.26,40.16 69.21,39.2 68.89,39.2 68.58,38.89 68.58,40.16 67.94,40.79 | 67.94,40.79 69.53,39.2 | 67.62,41.11 69.53,39.2 | 66.67,41.11 67.62,41.11 | 66.67,41.11 65.72,42.06 | 64.77,41.11 65.72,42.06 | IC6.12 98.74,41.43 100.01,42.7 IC4.19 | R9.1 88.58,10 89.85,8.73 v116.2,8.73 | 81.59,16.34 81.91,16.34 81.91,15.71 | 81.91,15.71 v81.91,11.26 | 81.28,16.34 81.91,15.71 | 81.91,15.71 82.55,16.34 | 12.06,23.96 U$6.K | 12.06,23.01 U$5.K | U$3.K U$4.K U$10.K U$9.K U$8.K U$7.K 12.38,37.3 12.06,36.98 U$6.K | U$6.K 12.06,24.92 13.01,23.96 12.06,23.01 | 12.06,23.96 12.06,23.01 | v33.01,23.96 12.06,23.96
  Bottom 0.61: 33.01,18.57 34.29,17.3 | 33.01,27.46 34.29,28.73 33.01,30 | 33.01,38.89 34.29,40.16 33.01,41.43 | 33.01,50.32 34.29,51.59 33.01,52.86 | 33.01,61.75 34.29,63.02 33.01,64.29 | 33.01,73.18 34.29,74.45 33.01,75.72 | 33.01,84.61 34.29,85.88 33.01,87.15 | 33.01,96.04 34.29,97.31
  Bottom 0.813: K1.1 34.29,97.31 33.01,97.31 33.01,96.04 33.01,87.15 33.01,85.88 | 33.01,85.88 34.29,85.88 K2.1 | 33.01,74.45 34.29,74.45 K3.1 | 33.01,74.45 33.01,75.72 33.01,84.61 33.01,85.88 | 33.01,63.02 34.29,63.02 K4.1 | 33.01,63.02 33.01,64.29 33.01,73.18 33.01,74.45 | 33.01,51.59 34.29,51.59 K5.1 | 33.01,51.59 33.01,52.86 33.01,61.75 33.01,63.02 | 33.01,40.16 34.29,40.16 K6.1 | 33.01,51.59 33.01,50.32 33.01,41.43 33.01,40.16 | 33.01,28.73 34.29,28.73 K7.1 | 33.01,40.16 33.01,38.89 33.01,30 33.01,28.73 | K8.1 34.29,17.3 33.01,17.3 33.01,18.57 v33.01,23.96 33.01,27.46 33.01,28.73 | IC3.4 IC3.5 76.83,60.48 IC4.10 78.1,64.92 78.1,66.19 76.19,68.1 IC3.8 | IC1.16 122.55,82.39 123.5,81.43 123.5,78.26 | 123.5,78.26 122.55,77.3 IC1.14 123.82,77.3 | 124.45,77.3 123.82,77.3 | 126.36,77.3 124.45,77.3 | 124.45,77.3 123.5,78.26 | 123.5,78.26 123.5,77.62 123.82,77.3 | 126.36,77.3 123.82,77.3 | 126.36,77.3 127,76.67 127,74.13 | IC6.12 94.61,41.43 93.02,39.84 93.02,37.62 91.75,36.35 IC7.10 | BUS.11 BUS.13 BUS.15 R9.1 | 127,72.86 7905..1 | 127,72.86 127,74.13 | 127.63,73.5 127,72.86 | 127.63,73.5 127,74.13 | 127.63,73.5 134.62,73.5 136.84,71.27 136.84,64.29 134.93,62.38 134.93,32.85 132.39,30.32 132.39,17.93 127.31,12.85 120.33,12.85 v116.2,8.73
N$55
  Bottom 0.254: 128.23,2.98 128.23,1.25
N$56
  Top 0.813: IC5.2 113.66,59.84 114.93,58.57 117.79,58.57 118.74,59.53 118.74,60.48 119.06,60.79 D10.A
  Bottom 0.813: D10.A 123.19,60.79 125.09,58.89 R14.1
N$57
  Top 0.813: U$1.10 80.64,77.3 81.91,78.58 81.91,84.29 82.55,84.93 R18.1
  Bottom 0.813: R17.2 78.1,98.26 76.83,96.99 76.83,93.5 | 76.83,93.5 C1.2 77.78,92.55 | 81.91,87.46 81.91,86.83 | 81.91,87.46 81.91,91.59 80.96,92.55 77.78,92.55 | 77.78,92.55 76.83,93.5 | 81.91,85.88 81.91,87.46 | R18.1 82.55,84.93 | 82.55,84.93 81.91,84.93 81.91,85.88 | 81.91,85.88 81.91,85.56 82.55,84.93
N$58
  Bottom 0.813: D12.A D10.C 128.58,62.38 117.79,62.38 IC5.1
N$59
  Bottom 0.61: 25.4,17.93 26.03,17.3 | 25.4,30 26.66,28.73 25.4,27.46 | 25.4,38.89 26.66,40.16 25.4,41.43 | 25.4,50.32 26.66,51.59 25.4,52.86 | 25.4,64.29 26.66,63.02 25.4,61.75 | 25.4,73.18 26.66,74.45 25.4,75.72 | 25.4,96.04 26.66,97.31
  Bottom 0.813: 25.4,63.02 25.4,64.29 25.4,73.18 25.4,74.45 | 25.4,51.59 25.4,52.86 25.4,61.75 25.4,63.02 | 25.4,51.59 25.4,50.32 25.4,41.43 25.4,40.16 | 25.4,40.16 25.4,38.89 25.4,30 25.4,28.73 | 25.4,28.73 25.4,27.46 25.4,17.93 25.4,17.3 26.03,17.3 K8.P1 | 25.4,74.45 25.4,75.72 25.4,85.88 | 25.4,85.88 25.4,96.04 25.4,97.31 26.66,97.31 K1.P1 27.94,97.94 29.52,99.53 58.73,99.53 R16.1 | 25.4,85.88 K2.P1 | 25.4,74.45 26.66,74.45 K3.P1 | 25.4,40.16 26.66,40.16 K6.P1 | 25.4,28.73 26.66,28.73 K7.P1 | K5.P1 26.66,51.59 25.4,51.59 | 25.4,63.02 26.66,63.02 K4.P1
N$60
  Bottom 0.813: C3.1 U$1.1
N$61
  Bottom 0.254: 129.11,5.8 131.38,9.2
N$62
  Bottom 0.813: U$1.2 64.13,84.93 63.18,85.88 C2.1
N$63  (via drill 0.61)
  Top 0.813: R13.1 114.61,44.92 113.66,43.97 D13.A | IC5.6 111.12,51.27 111.44,50.95 v114.93,50.95
  Bottom 0.813: R12.2 120.65,45.87 119.69,44.92 R13.1 v114.93,50.95
N$64
  Bottom 0.813: 111.12,43.97 113.66,46.51 IC5.7 | IC6.4 110.48,43.97 | 111.12,42.06 111.12,36.67 113.34,34.44 D11.A | 111.12,43.33 111.12,42.06 | 111.12,43.97 111.12,43.33 | 110.48,43.97 111.12,43.97 | 110.48,43.97 111.12,43.33 | D13.C 123.82,42.06 123.19,42.7 111.76,42.7 | 111.12,43.33 111.76,42.7 | 111.12,42.06 111.76,42.7
N$65
  Top 0.813: C6.2 81.59,102.07 80.64,101.12 80.64,96.04 81.59,95.08 R18.2
  Bottom 0.813: C6.2 C8.2 R19.1
N$66
  Top 0.813: U$2.10 90.48,67.46 91.12,66.83 R24.2
  Bottom 0.813: R12.1 112.07,58.57 111.12,59.53 IC5.3 111.12,62.07 109.85,63.33 107.94,63.33 105.09,66.19 R24.2 104.77,71.59 106.68,73.5 C12.2
N$67
  Bottom 0.813: U$1.4 73.97,79.85 74.61,80.48 74.61,88.42 71.75,91.27 C1.1 70.16,94.13 70.16,97.63 | 70.16,97.63 R16.2 70.8,98.26 | 70.8,98.26 R17.1 | 70.16,97.63 70.8,98.26
N$68  (via drill 0.61)
  Top 0.813: IC1.15 134.3,79.85 138.43,75.72 138.43,53.81 135.25,50.64 135.25,23.33 125.09,13.17 120.65,13.17 118.11,10.63 118.11,8.41 116.52,6.82 v61.59,6.82 | v61.91,39.2 v66.99,39.2
  Bottom 0.813: v61.59,6.82 61.59,8.73 57.14,13.17 57.14,34.44 v61.91,39.2 | IC7.15 80.96,40.16 80,39.2 v66.99,39.2
N$69
  Bottom 0.813: C7.1 88.9,88.74 R21.1 R20.2 89.85,96.04 90.8,96.99 C8.1
N$70
  Bottom 0.813: U$2.1 C14.1
N$71
  Top 0.813: IC1.4 111.76,74.76 111.12,74.13 111.12,71.59 110.8,71.27 C18.1
  Bottom 0.813: R19.2 113.02,89.69 111.12,87.78 111.12,75.72 112.07,74.76 IC1.4 | C5.1 108.26,65.87 107.31,66.83 107.31,70.32 108.26,71.27 C18.1
N$72  (via drill 0.61)
  other vias: 114.93,50.95
N$73
  Bottom 0.813: C13.1 96.2,81.43 98.1,79.53 U$2.2 98.1,76.35
N$74
  Bottom 0.813: U$2.4 93.02,75.4 94.61,73.81 103.82,73.81 104.77,74.76 R24.1 104.77,79.85 106.68,81.75 106.68,83.02 | 106.04,83.66 C12.1 106.68,83.02 | 106.04,83.66 105.4,83.66 104.45,84.61 R23.2 | 106.68,83.02 106.04,83.66
N$82
  Top 1.016: R10.1 39.37,90.32 35.55,94.13 U$3.A
N$83
  Top 0.813: U$4.A 39.37,82.7 41.59,84.93 R11.1
N$84
  Top 0.813: U$5.A 39.68,14.44 41.27,16.03 R30.1
N$85
  Top 0.813: R29.1 39.05,27.77 37.14,25.87 U$6.A
N$86  (via drill 0.61)
  Top 0.813: U$7.A 39.68,37.3 v40.95,38.57
  Bottom 0.813: R28.1 v40.95,38.57
N$87
  Top 0.813: U$8.A 37.46,48.41 39.05,50 39.05,53.18 39.37,53.49 R27.1
N$88
  Top 0.813: U$9.A 39.68,59.84 40.95,61.11 R26.1
N$89
  Top 0.813: U$10.A 37.78,71.59 39.05,72.86 R25.1
N$128
  Bottom 0.254: 128.63,6.15 130.93,9.6
N$130
  Bottom 0.254: 124.83,9.63 127.11,6.15
N$138
  Bottom 0.61: 130.52,9.58 128.51,6.48 127.91,6.69 130.12,9.84 129,10.3 127.32,10.52 126.17,10.24 125.18,9.58 127.26,6.57 127.63,6.59 129.44,9.82 127.25,10.14 125.67,9.36 127.54,6.76 128.73,9.84 126.06,9.16 127.42,7.43 128.12,9.62 126.55,8.95 127.36,8.16 127.44,9.1 127.28,10.18
N$147
  Bottom 0.61: 131.45,8.72 132.29,7 132.33,5.65 132.03,4.37 131.6,3.51 130.73,2.67 129.7,1.92 128.47,1.57 128.61,2.78 129.65,3.61 129.84,4.77 129.73,5.27 129.47,5.82 131.19,8.34 131.64,7.57 131.31,7.54 129.92,5.52 130.15,5.06 131.84,7.34 131.83,4.34 129.69,2.12 128.74,2.26 129.41,3.02 129.59,2.46 129.99,3.38 130.69,3.52 130.02,4 131.12,3.95 130.08,4.64 131.52,4.33 130.42,5.04 131.64,4.92 130.85,5.43 131.51,5.67 131.32,6.29
PB0
  Bottom 0.813: BUS.2 70.48,21.11 70.8,21.42 IC7.2
PB1
  Bottom 0.813: IC7.3 73.34,36.67 BUS.4
PB2
  Bottom 0.813: BUS.6 75.56,21.11 75.88,21.42 IC7.4
PB3
  Bottom 0.813: BUS.8 IC7.5
PB4
  Bottom 0.813: BUS.10 IC7.6
PB5
  Bottom 0.813: BUS.12 IC7.7
PB6
  Bottom 0.813: BUS.14 IC7.8
PB7  (via drill 0.61)
  Top 0.813: IC4.18 97.47,53.81 97.15,53.49 95.24,53.49 94.29,52.54 v94.29,34.76
  Bottom 0.813: BUS.16 88.58,33.17 88.9,33.49 93.02,33.49 v94.29,34.76
TREF
  Bottom 0.813: 107.94,11.26 TR1.1 | R9.2 107.63,10.95 107.94,11.26 | 107.94,11.26 112.71,11.26 114.61,13.17 114.61,18.89 X3.1
V0
  Bottom 0.813: R14.2 R13.2 D12.C 130.17,35.71 128.9,34.44 D11.C 123.82,31.9 122.87,30.95 120.65,30.95 119.69,30 X3.2
(copper drawn outside any net)
  Bottom 0.254: 128.23,2.98 arc125 129.01,5.88 | 127.01,6.08 arc-58 128.65,6.13 | 128.2,1.28 arc128 131.38,9.23 | 124.73,9.6 arc-82 130.95,9.6
  shapes: Bottom circle x10

### Text on the board
Bottom: LMPT | Amplificador G1000 - Junho 2007